# EAGLE schematic birth1.brd2 (EAGLE 7.3.0)
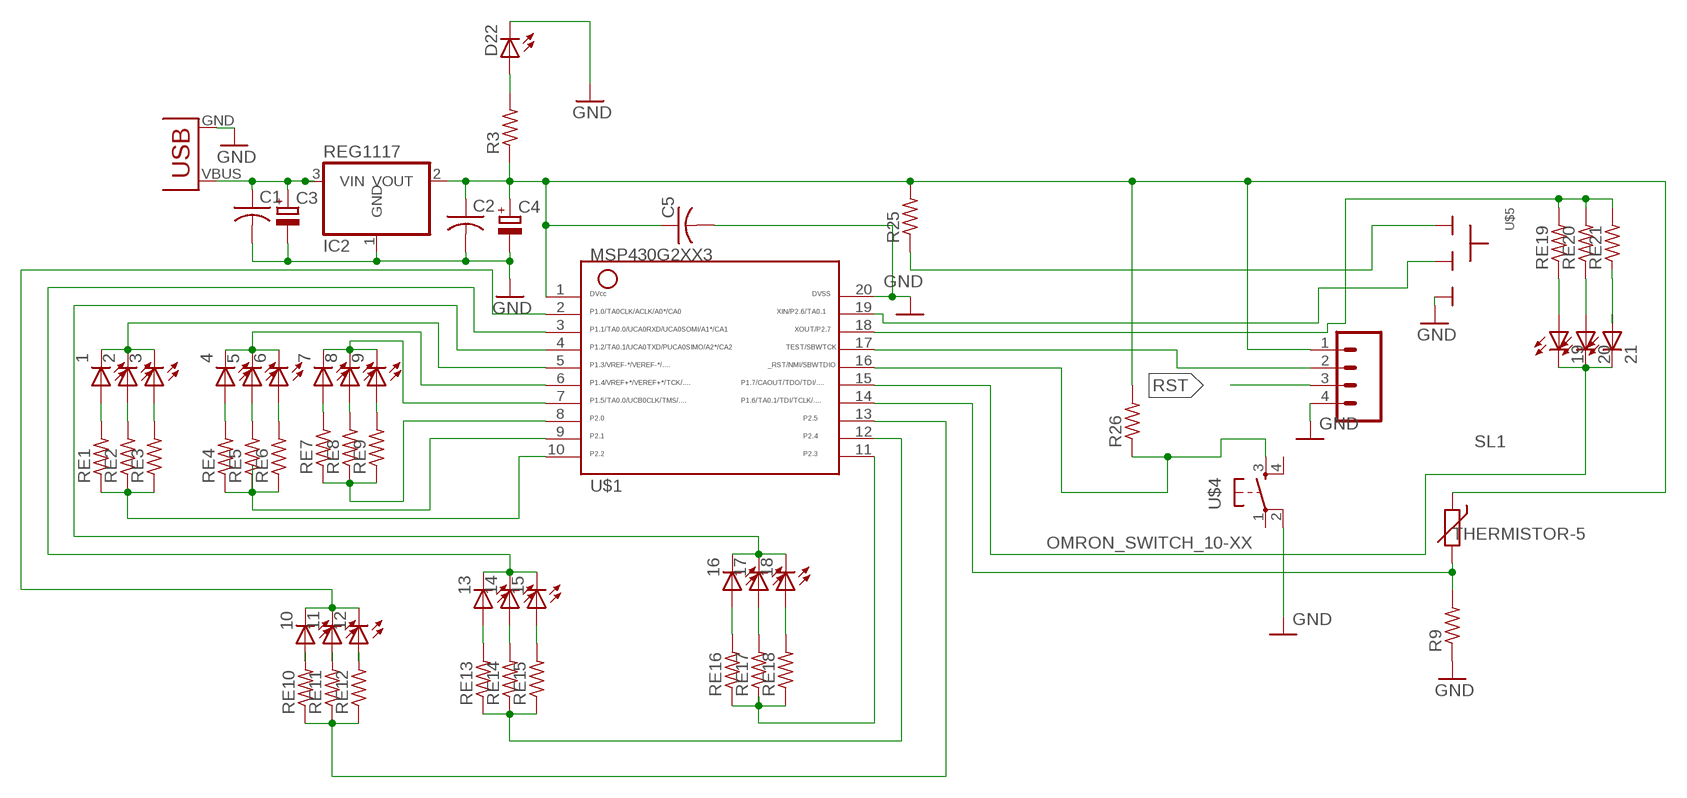
[diagram p0: schematic, sheet 1]

## Parts
1  LED3MM  [LED3MM]
2  LED3MM  [LED3MM]
3  LED3MM  [LED3MM]
4  LED3MM  [LED3MM]
5  LED3MM  [LED3MM]
6  LED3MM  [LED3MM]
7  LED3MM  [LED3MM]
8  LED3MM  [LED3MM]
9  LED3MM  [LED3MM]
10  LED3MM  [LED3MM]
11  LED3MM  [LED3MM]
12  LED3MM  [LED3MM]
13  LED3MM  [LED3MM]
14  LED3MM  [LED3MM]
15  LED3MM  [LED3MM]
16  LED3MM  [LED3MM]
17  LED3MM  [LED3MM]
18  LED3MM  [LED3MM]
19  LED3MM  [LED3MM]
20  LED3MM  [LED3MM]
21  LED3MM  [LED3MM]
C1  C-US025-025X050  [C025-025X050]
C2  C-US025-025X050  [C025-025X050]
C3  CPOL-EUE2.5-7  [E2,5-7]
C4  CPOL-EUE2.5-7  [E2,5-7]
C5  C-US025-025X050  [C025-025X050]
D22  LED3MM  [LED3MM]
IC2  REG1117  [SOT223]
R3  R-US_0204/7  [0204/7]
R8  THERMISTOR-5  [R-5]
R9  R-US_0204/7  [0204/7]
R25  R-US_0204/7  [0204/7]
R26  R-US_0204/7  [0204/7]
RE1  R-US_0204/7  [0204/7]
RE2  R-US_0204/7  [0204/7]
RE3  R-US_0204/7  [0204/7]
RE4  R-US_0204/7  [0204/7]
RE5  R-US_0204/7  [0204/7]
RE6  R-US_0204/7  [0204/7]
RE7  R-US_0204/7  [0204/7]
RE8  R-US_0204/7  [0204/7]
RE9  R-US_0204/7  [0204/7]
RE10  R-US_0204/7  [0204/7]
RE11  R-US_0204/7  [0204/7]
RE12  R-US_0204/7  [0204/7]
RE13  R-US_0204/7  [0204/7]
RE14  R-US_0204/7  [0204/7]
RE15  R-US_0204/7  [0204/7]
RE16  R-US_0204/7  [0204/7]
RE17  R-US_0204/7  [0204/7]
RE18  R-US_0204/7  [0204/7]
RE19  R-US_0204/7  [0204/7]
RE20  R-US_0204/7  [0204/7]
RE21  R-US_0204/7  [0204/7]
SL1  M04  [04P]
U$1  MSP430G2553DIP20  [G2553-DIP20]
U$2  USB(POWER)  [USB(POWER)]
U$4  OMRON_SWITCH_10-XX  [B3F-10XX]
U$5  SLIDESWITCH-BIG  [BIGSWITCH]

## Nets
GND: C1.2 C2.2 C3.- C4.- C5.2 D22.K(C) IC2.1(GND) R9.1 SL1.4 U$1.20 U$2.GND U$4.2(P1) U$5.3
N$1: 7.K(C) 8.K(C) 9.K(C) U$1.7
N$2: 3.A RE3.2
N$3: 10.K(C) 11.K(C) 12.K(C) U$1.2
N$4: 2.A RE2.2
N$6: RE7.1 RE8.1 RE9.1 U$1.8
N$7: 4.A RE4.2
N$8: 1.K(C) 2.K(C) 3.K(C) U$1.5
N$9: RE1.1 RE2.1 RE3.1 U$1.10
N$10: 4.K(C) 5.K(C) 6.K(C) U$1.6
N$12: 5.A RE5.2
N$13: 13.K(C) 14.K(C) 15.K(C) U$1.3
N$14: 21.A RE21.1
N$15: 16.K(C) 17.K(C) 18.K(C) U$1.4
N$16: SL1.2 U$1.17
N$17: 20.A RE20.1
N$18: RE13.1 RE14.1 RE15.1 U$1.12
N$19: R25.1 U$5.1
N$20: 19.K(C) 20.K(C) 21.K(C) U$1.15
N$21: RE19.2 RE20.2 RE21.2 U$1.18
N$22: R8.2 R9.2 U$1.14
N$23: 1.A RE1.2
N$24: C1.1 C3.+ IC2.3(VIN) U$2.VBUS(VCC)
N$25: D22.A R3.2
N$26: 6.A RE6.2
N$27: RE4.1 RE5.1 RE6.1 U$1.9
N$28: 7.A RE7.2
N$29: 8.A RE8.2
N$30: 9.A RE9.2
N$31: RE10.1 RE11.1 RE12.1 U$1.13
N$32: U$1.19 U$5.2
N$33: RE16.1 RE17.1 RE18.1 U$1.11
N$34: 10.A RE10.2
N$35: 11.A RE11.2
N$36: 12.A RE12.2
N$37: 13.A RE13.2
N$38: 14.A RE14.2
N$39: 15.A RE15.2
N$40: 16.A RE16.2
N$41: 17.A RE17.2
N$42: 18.A RE18.2
N$43: C2.1 C4.+ C5.1 IC2.2(VOUT) R3.1 R8.1 R25.2 R26.2 SL1.1 U$1.1
N$44: 19.A RE19.1
RST: R26.1 SL1.3 U$1.16 U$4.3(S)
Unconnected: U$4.1(P) U$4.4(S1)

## Library data of the parts
1-21 D22 = led:LED: LED OSRAM: - CHIPLED LG R971, LG N971, LY N971, LG Q971, LY Q971, LO R971, LY R971 LH N974, LH R974 LS Q976, LO Q976, LY Q976 LO Q996 - Hyper CHIPLED LW Q18S LB Q993, LB Q99A, LB R99A - SideLED LS A670, LO A670, LY A670, LG A670, LP A670 LB A673, LV A673, LT A673, LW A673 LH A674 LY A675 LS A676, LA A676, LO A676, LY A676, LW A676 LS A679, LY A679, LG A679 - Hyper Micro SIDELED® LS Y876, LA Y876, LO Y876, LY Y876 LT Y87S - SmartLED LW L88C, LW L88S LB L89C, LB L89S, LG L890 LS L89K, LO L89K, LY L89K LS L896, LA L896, LO L896, LY L896 - TOPLED LS T670, LO T670, LY T670, LG T670, LP T670 LSG T670, LSP T670, LSY T670, LOP T670, LYG T670 LG T671, LOG T671, LSG T671 LB T673, LV T673, LT T673, LW T673 LH T674 LS T676, LA T676, LO T676, LY T676, LB T676, LH T676, LSB T676, LW T676 LB T67C, LV T67C, LT T67C, LS T67K, LO T67K, LY T67K, LW E67C LS E67B, LA E67B, LO E67B, LY E67B, LB E67C, LV E67C, LT E67C LW T67C LS T679, LY T679, LG T679 LS T770, LO T770, LY T770, LG T770, LP T770 LB T773, LV T773, LT T773, LW T773 LH T774 LS E675, LA E675, LY E675, LS T675 LS T776, LA T776, LO T776, LY T776, LB T776 LHGB T686 LT T68C, LB T68C - Hyper Mini TOPLED® LB M676 - Mini TOPLED Santana® LG M470 LS M47K, LO M47K, LY M47K Source: http://www.osram.convergy.de LUXEON: - LUMILED® LXK2-PW12-R00, LXK2-PW12-S00, LXK2-PW14-U00, LXK2-PW14-V00 LXK2-PM12-R00, LXK2-PM12-S00, LXK2-PM14-U00 LXK2-PE12-Q00, LXK2-PE12-R00, LXK2-PE12-S00, LXK2-PE14-T00, LXK2-PE14-U00 LXK2-PB12-K00, LXK2-PB12-L00, LXK2-PB12-M00, LXK2-PB14-N00, LXK2-PB14-P00, LXK2-PB14-Q00 LXK2-PR12-L00, LXK2-PR12-M00, LXK2-PR14-Q00, LXK2-PR14-R00 LXK2-PD12-Q00, LXK2-PD12-R00, LXK2-PD12-S00 LXK2-PH12-R00, LXK2-PH12-S00 LXK2-PL12-P00, LXK2-PL12-Q00, LXK2-PL12-R00 Source: www.luxeon.com KINGBRIGHT: KA-3528ASYC Source: www.kingbright.com
C1 C2 C5 = rcl:C-US: CAPACITOR, American symbol
C3 C4 = rcl:CPOL-EU: POLARIZED CAPACITOR, European symbol
IC2 = CEDT_JANUARY_2015_v5:REG1117: 800mA and 1A Low Dropout (LDO) Positive Regulator 1.8V, 2.5V, 2.85V, 3.3V, 5V, and Adj
R3 R9 R25 R26 RE1-RE21 = resistor:R-US_: RESISTOR, American symbol
R8 = varistor:THERMISTOR: THERMISTOR
SL1 = con-amp-quick:M04: AMP QUICK CONNECTOR; OC_FARNELL: unknown; OC_NEWARK: unknown
U$1 = CEDT_JANUARY_2015_v5:MSP430G2553
U$2 = CEDT_JANUARY_2015_v5:USB(POWER)
U$4 = CEDT_JANUARY_2015_v5:OMRON_SWITCH
U$5 = CEDT_JANUARY_2015_v5:SLIDESWITCH

## Net classes
0 default: width 0.61 mm